# Altium schematic sheet STM32F103T8.SchDoc
size A3; Revision: 10
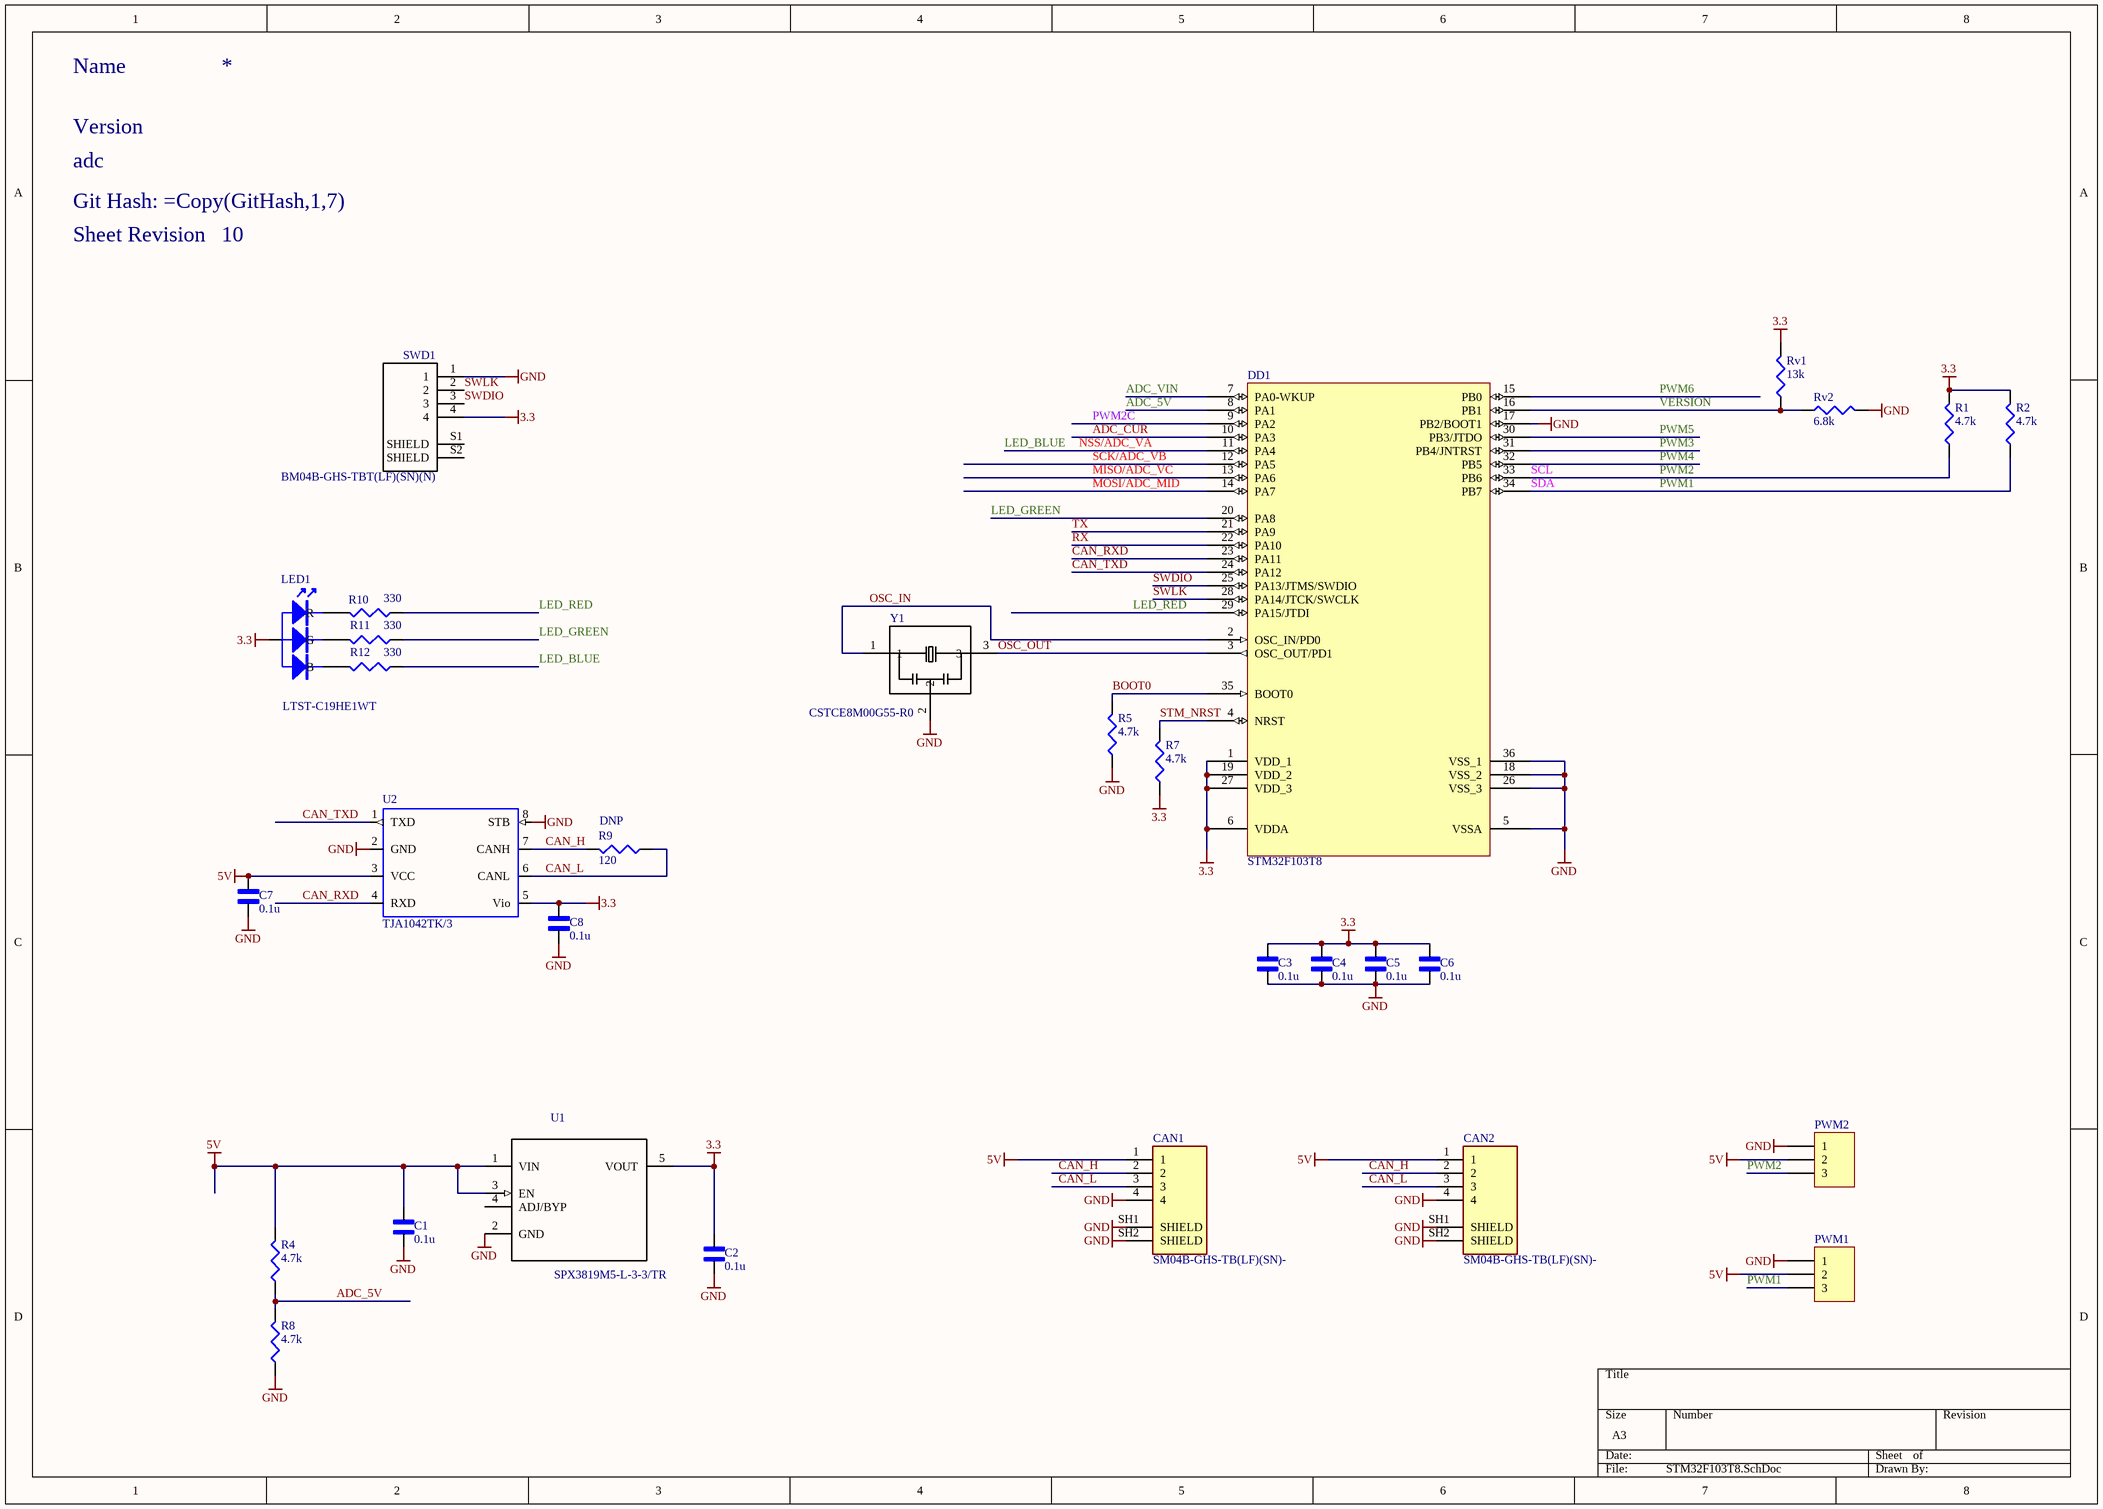
[diagram p0: STM32F103T8.SchDoc]

## Parts
C1  value 0.1u  [CAPC1005X55N]  (hidden comment: GCM155R71H104KE02D)
C2  value 0.1u  [CAPC1005X55N]  (hidden comment: GCM155R71H104KE02D)
C3  value 0.1u  [CAPC1005X55N]  (hidden comment: GCM155R71H104KE02D)
C4  value 0.1u  [CAPC1005X55N]  (hidden comment: GCM155R71H104KE02D)
C5  value 0.1u  [CAPC1005X55N]  (hidden comment: GCM155R71H104KE02D)
C6  value 0.1u  [CAPC1005X55N]  (hidden comment: GCM155R71H104KE02D)
C7  value 0.1u  [CAPC1005X55N]  (hidden comment: GCM155R71H104KE02D)
C8  value 0.1u  [CAPC1005X55N]  (hidden comment: GCM155R71H104KE02D)
CAN1  SM04B-GHS-TB(LF)(SN)-  [JST_SM04B-GHS-TB(LF)(SN)-]
CAN2  SM04B-GHS-TB(LF)(SN)-  [JST_SM04B-GHS-TB(LF)(SN)-]
DD1  STM32F103T8  [*QFN50P600X600X100-37N]
LED1  LTST-C19HE1WT  [LTST-C19HE1WT]
PWM1  A  [HDR Side 3 pin]  (value not drawn)
PWM2  A  [HDR Side 3 pin]  (value not drawn)
R1  value 4.7k  [RESC1005X40N]  (hidden comment: RC0402FR-074K7L)
R2  value 4.7k  [RESC1005X40N]  (hidden comment: RC0402FR-074K7L)
R4  value 4.7k  [RESC1005X40N]  (hidden comment: RC0402FR-074K7L)
R5  value 4.7k  [RESC1005X40N]  (hidden comment: RC0402FR-074K7L)
R7  value 4.7k  [RESC1005X40N]  (hidden comment: RC0402FR-074K7L)
R8  value 4.7k  [RESC1005X40N]  (hidden comment: RC0402FR-074K7L)
R9  value 120  Instructions: DNP  [J1-0603]  (hidden comment: Res3)
R10  value 330  [RESC1005X40N]  (hidden comment: RC0402FR-07330RL)
R11  value 330  [RESC1005X40N]  (hidden comment: RC0402FR-07330RL)
R12  value 330  [RESC1005X40N]  (hidden comment: RC0402FR-07330RL)
Rv1  value 13k  [RESC1005X40N]  (hidden comment: RC0402FR-0713KL)
Rv2  value 6.8k  [RESC1005X40N]  (hidden comment: RC0402FR-076K8L)
SWD1  BM04B-GHS-TBT(LF)(SN)(N)  [JST_BM04B-GHS-holes]
U1  SPX3819M5-L-3-3/TR  [*SOT95P280X145-5N]
U2  TJA1042TK/3  [SOT782-1]
Y1  CSTCE8M00G55-R0  [*OSC_CSTCE8M00G55-R0]

## Nets
3.3: C2.2 C3.2 C4.2 C5.2 C6.2 C8.2 DD1.1(VDD_1) DD1.6(VDDA) DD1.19(VDD_2) DD1.27(VDD_3) LED1.4(A) R1.2 R2.2 R7.1 Rv1.2 SWD1.4 U1.5(VOUT) U2.5(Vio)
5V: C1.2 C7.2 CAN1.1 CAN2.1 PWM1.2 PWM2.2 R4.2 U1.1(VIN) U1.3(EN) U2.3(VCC)
GND: C1.1 C2.1 C3.1 C4.1 C5.1 C6.1 C7.1 C8.1 CAN1.4 CAN1.SH1(SHIELD) CAN1.SH2(SHIELD) CAN2.4 CAN2.SH1(SHIELD) CAN2.SH2(SHIELD) DD1.5(VSSA) DD1.17(PB2/BOOT1) DD1.18(VSS_2) DD1.26(VSS_3) DD1.36(VSS_1) PWM1.1 PWM2.1 R5.1 R8.1 Rv2.2 SWD1.1 U1.2(GND) U2.2(GND) U2.8(STB) Y1.2
ADC_5V: DD1.8(PA1) R4.1 R8.2
ADC_CUR: DD1.10(PA3)
ADC_VIN: DD1.7(PA0-WKUP)
BOOT0: DD1.35(BOOT0) R5.2
CAN_H: CAN1.2 CAN2.2 R9.2 U2.7(CANH)
CAN_L: CAN1.3 CAN2.3 R9.1 U2.6(CANL)
CAN_RXD: DD1.23(PA11) U2.4(RXD)
CAN_TXD: DD1.24(PA12) U2.1(TXD)
LED_BLUE: DD1.11(PA4) R12.1  [also labelled NSS/ADC_VA]
LED_GREEN: DD1.20(PA8) R11.1
LED_RED: DD1.29(PA15/JTDI) R10.1
MISO/ADC_VC: DD1.13(PA6)
MOSI/ADC_MID: DD1.14(PA7)
OSC_IN: DD1.2(OSC_IN/PD0) Y1.1
OSC_OUT: DD1.3(OSC_OUT/PD1) Y1.3
PWM1: DD1.34(PB7) PWM1.3 R2.1  [also labelled SDA]
PWM2: DD1.33(PB6) PWM2.3 R1.1  [also labelled SCL]
PWM2C: DD1.9(PA2)
PWM3: DD1.31(PB4/JNTRST)
PWM4: DD1.32(PB5)
PWM5: DD1.30(PB3/JTDO)
PWM6: DD1.15(PB0)
RX: DD1.22(PA10)
SCK/ADC_VB: DD1.12(PA5)
STM_NRST: DD1.4(NRST) R7.2
SWDIO: DD1.25(PA13/JTMS/SWDIO) SWD1.3
SWLK: DD1.28(PA14/JTCK/SWCLK) SWD1.2
TX: DD1.21(PA9)
VERSION: DD1.16(PB1) Rv1.1 Rv2.1
NetLED1_1: LED1.1(R) R10.2
NetLED1_2: LED1.2(G) R11.2
NetLED1_3: LED1.3(B) R12.2

Not connected (* = marked no-connect by the designer): SWD1 S1(SHIELD) S2(SHIELD); U1 4(ADJ/BYP)

## Notes on the sheet
- Name
- Version
- adc
- Sheet Revision

## Library data of the parts
C1-C8 = GCM155R71H104KE02D: GCM155R71H104KE02D, Чип 0402 X7R 0.1uF +10% 50V,Конденсатор; MF: Murata; Type: SMD; SnapEDA_Link: https://www.snapeda.com/parts/GCM155R71H104KE02D/Murata%20Electronics%20North%20America/view-part/597463/?ref=snap; Package: 0402; MP: GCM155R71H104KE02D; ChipDip_Link: https://www.chipdip.ru/product/gcm155r71h104ke02d-murata
CAN1 CAN2 = SM04B-GHS-TB(LF)(SN)-: Connector Header Surface Mount, Right Angle 4 position 0.049 _1.25mm_; MF: JST Sales; MP: SM04B-GHS-TB(LF)(SN); Package: None; Value: *; SnapEDA_Link: https://www.snapeda.com/parts/SM04B-GHS-TB%28LF%29%28SN%29-/JST%20Sales%20America%20Inc./view-part/2759740/?ref=snap; HelpURL: http://www.farnell.com/datasheets/2082975.pdf; System: Connector; ChipDip_Link: https://www.chipdip.ru/product/sm04b-ghs-tb-lf-sn-gh-1.25mm-header-side-ent; Type: SMD
DD1 = STM32F103T8: STM32F103T8U6, Микроконтроллер 32BIT ARM 64K FLASH [VFQFPN-36]; MF: STM; ChipDip_Link: https://www.chipdip.ru/product/stm32f103t8u6-2; HelpURL: http://www.st.com/stonline/products/literature/ds/13587.pdf; MP: STM32F103T8U6; Package: VFQFPN-36; SnapEDA_Link: https://www.snapeda.com/parts/STM32F103T8U6TR/STMicroelectronics/view-part/?ref=search&t=STM32F103T8U6; Type: SMD
LED1 = RGB_LED_5MM: Blue/Green/Red; Type: SMD; ChipDip_Link: https://www.chipdip.ru/product1/8003387462; HelpURL: https://static.chipdip.ru/lib/039/DOC013039662.pdf; MP: LTST-C19HE1WT
PWM1 PWM2 = Header 3: Header, 3-Pin; Instructions: placed to the side; see picture; System: Connector; MF: Connfly electronic (Zhenqin); MP: PLS-3 (DS1021-1x3); Type: SMD; ChipDip_Link: https://www.chipdip.ru/product/pls-3; HelpURL: https://static.chipdip.ru/lib/227/DOC000227157.pdf
R1 R2 R4 R5 R7 R8 = RC0402FR-074K7L: 0.062Вт 0402 4.7 кОм, 1%, Чип резистор (SMD); Pacage Metric: 1005; MF: Yageo or NXP; ChipDip_Link: https://www.chipdip.ru/product0/9000189640; HelpURL: https://www.chipdip.ru/product0/9000189640; Package: RC0402; Type: SMD; MP: RC0402FR-074K7L; SnapEDA_Link: https://www.snapeda.com/parts/CRGCQ0402F10K/TE%20Connectivity/view-part/3186991/?ref=search&t=0402%2010k
R9 = Res3: 120 Ohms 1 0.1 W 1 10 W Chip Resistor 0603 1608 Metric Thick Film; Pacage Metric: 1608; MP: RC0603FR-07120RL; ChipDip_Link: https://www.chipdip.ru/product0/9000079618; HelpURL: https://www.chipdip.ru/product0/9000079618; Package: R0603; Type: SMD
R10-R12 = RC0402FR-07330RL: 0.062Вт 0402 330 Ом, 1%, Чип резистор (SMD); Pacage Metric: 1005; MF: Yageo or NXP; ChipDip_Link: https://www.chipdip.ru/product0/9000189640; HelpURL: https://www.chipdip.ru/product0/9000189640; Package: RC0402; Type: SMD; MP: RC0402FR-07330RL; SnapEDA_Link: https://www.snapeda.com/parts/CRGCQ0402F10K/TE%20Connectivity/view-part/3186991/?ref=search&t=0402%2010k
Rv1 = RC0402FR-0713KL: 0.062Вт 0402 13 кОм, 1%, Чип резистор (SMD); Pacage Metric: 1005; MF: Yageo or NXP; ChipDip_Link: https://www.chipdip.ru/product0/9000189640; HelpURL: https://www.chipdip.ru/product0/9000189640; Package: RC0402; Type: SMD; MP: RC0402FR-0713KL; SnapEDA_Link: https://www.snapeda.com/parts/CRGCQ0402F10K/TE%20Connectivity/view-part/3186991/?ref=search&t=0402%2010k
Rv2 = RC0402FR-076K8L: 0.062Вт 0402 6.8 кОм, 1%, Чип резистор (SMD); Pacage Metric: 1005; MF: Yageo or NXP; ChipDip_Link: https://www.chipdip.ru/product0/9000189640; HelpURL: https://www.chipdip.ru/product0/9000189640; Package: RC0402; Type: SMD; MP: RC0402FR-076K8L; SnapEDA_Link: https://www.snapeda.com/parts/CRGCQ0402F10K/TE%20Connectivity/view-part/3186991/?ref=search&t=0402%2010k
SWD1 = BM04B-GHS-TBT(LF)(SN)(N): Conn Shrouded Header HDR 4 POS 1.25mm Solder ST SMD Reel; MF: JST Sales; MP: SM04B-GHS-TB(LF)(SN); Instructions: DNP; System: Connector; SnapEDA_Link: https://www.snapeda.com/parts/BM04B-GHS-TBT%28LF%29%28SN%29%28N%29/JST%20Sales%20America%20Inc./view-part/?ref=snap; Package: None; Value: *; Type: SMD
U1 = SPX3819M5-L: Low Dropout Voltage Regulator, Adjustable 0.5A, В±1%, 2.5 to 16 Vin, 5-Pin SOT-23; MF: MaxLinear, Inc.; Value: 3V3; MP: SPX3819M5-L-3-3/TR; Package: SOT-23-5 Exar; SnapEDA_Link: https://www.snapeda.com/parts/SPX3819M5-L/MaxLinear%2C%20Inc./view-part/?ref=snap; Type: SMD; ChipDip_Link: https://www.chipdip.ru/product1/8003455237; HelpURL: http://www.farnell.com/datasheets/2614478.pdf
U2 = TJA1042TK/3: 1/1 Transceiver Half CANbus 8-SO; MF: NXP USA; SnapEDA_Link: https://www.snapeda.com/parts/TJA1042/NXP%20USA%20Inc./view-part/900919/?ref=snap; Value: *; MP: TJA1042TK/3; Package: VDFN-8 NXP USA; ChipDip_Link: https://www.chipdip.ru/product1/8002988465; HelpURL: https://static.chipdip.ru/lib/583/DOC001583059.pdf; Type: SMD
Y1 = CSTCE8M00G55-R0: Ceramic Resonator 8MHz ??0.5% _Tol_ ??0.2% _Stability_ 33pF 40Ohm 3-Pin CSMD T/R; MP: CSTCE8M00G55-R0 or CSTCE8M00G52-R0; MF: Murata; Package: SMD-3 Murata; SnapEDA_Link: https://www.snapeda.com/parts/CSTCE8M00G55-R0/Murata%20Electronics%20North%20America/view-part/?ref=snap; Value: *; ChipDip_Link: https://www.chipdip.ru/product1/8001783721; HelpURL: https://www.murata.com/en-eu/api/pdfdownloadapi?cate=&partno=CSTCE8M00G55-R0; Type: SMD